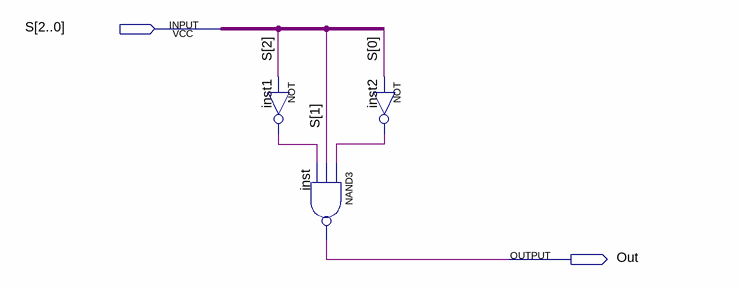
[diagram p0: schematic sheet]
// Quartus schematic enable_A.bdf as structural Verilog: 3 symbols, 2 pins
module enable_A (
  input  [2:0] S,
  output Out
);

  wire inst1_out, inst2_out;

  not inst1 (inst1_out, S[2]);
  nand inst (Out, inst2_out, S[1], inst1_out);
  not inst2 (inst2_out, S[0]);
endmodule
